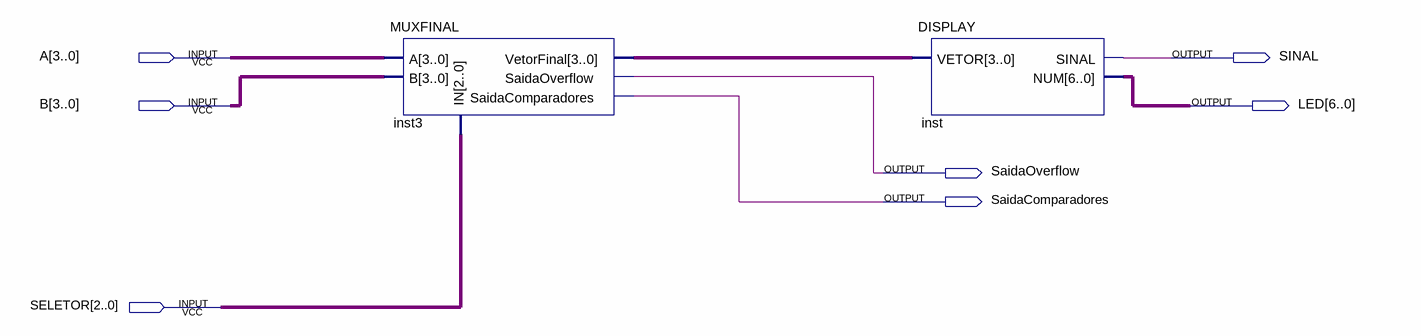
[diagram p0: schematic sheet]
// Quartus schematic ULA.bdf as structural Verilog: 2 symbols, 7 pins
module ULA (
  input  [3:0] A,
  input  [3:0] B,
  input  [2:0] SELETOR,
  output SINAL,
  output [6:0] LED,
  output SaidaOverflow,
  output SaidaComparadores
);

  wire [3:0] inst3_vetorfinal;

  MUXFINAL inst3 (
    .A(A), .B(B), .IN(SELETOR), .VetorFinal(inst3_vetorfinal), .SaidaOverflow(SaidaOverflow),
    .SaidaComparadores(SaidaComparadores));
  DISPLAY inst (.VETOR(inst3_vetorfinal), .SINAL(SINAL), .NUM(LED));
endmodule
